# EAGLE design Bomba (EAGLE 6.3)
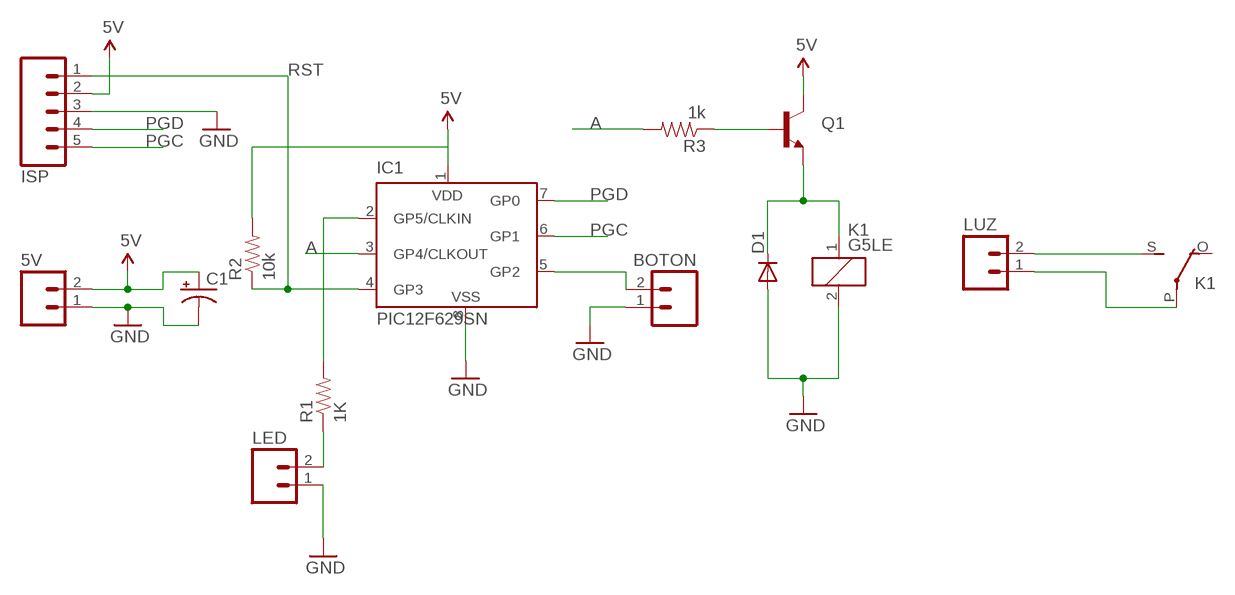
[diagram p0: schematic, sheet 1]

## Parts
5V  M025MM  [SCREWTERMINAL-5MM-2]
BOTON  M025MM  [SCREWTERMINAL-5MM-2]
C1  CAP_POLPTH1  [CPOL-RADIAL-100UF-25V]
D1  DIODE1N4148  [DIODE-1N4148]
IC1  PIC12F629SN  [SO-08]
ISP  M05LOCK_LONGPADS  [1X05_LOCK_LONGPADS]
K1  G5LE  [G5LE]
LED  M02LOCK_LONGPADS  [1X02_LOCK_LONGPADS]
LUZ  M025MM  [SCREWTERMINAL-5MM-2]
Q1  TRANSISTOR_NPNSOT23  [SOT23]
R1  1K  RESISTOR1206  [1206]
R2  10k  RESISTOR1206  [1206]
R3  1k  RESISTOR1206  [1206]

## Nets
5V: 5V.2 C1.1(+) IC1.1(VDD) ISP.2 Q1.3(C) R2.2
A: IC1.3(GP4/CLKOUT) R3.2
GND: 5V.1 BOTON.1 C1.2(-) D1.A IC1.8(VSS) ISP.3 K1.2 LED.1
N$2: D1.C K1.1 Q1.2(E)
N$3: BOTON.2 IC1.5(GP2)
N$4: Q1.1(B) R3.1
N$6: K1.S(2:S) LUZ.2
N$7: K1.P(2:P) LUZ.1
N$8: IC1.2(GP5/CLKIN) R1.2
N$9: LED.2 R1.1
PGC: IC1.6(GP1) ISP.5
PGD: IC1.7(GP0) ISP.4
RST: IC1.4(GP3) ISP.1 R2.1
Unconnected: K1.O(2:O)

## Library data of the parts
5V BOTON LED LUZ = SparkFun-Connectors:M02: Header 2 Standard 2-pin 0.1" header. Use with straight break away headers (SKU : PRT-00116), right angle break away headers (PRT-00553), swiss pins (PRT-00743), machine pins (PRT-00117), and female headers (PRT-00115). Molex polarized connector foot print use with SKU : PRT-08233 with associated crimp pins and housings.
C1 = SparkFun-Passives:CAP_POL: Capacitor Polarized These are standard SMD and PTH capacitors. Normally 10uF, 47uF, and 100uF in electrolytic and tantalum varieties. Always verify the external diameter of the through hole cap, it varies with capacity, voltage, and manufacturer. The EIA devices should be standard.
D1 = SparkFun-DiscreteSemi:DIODE: Diode These are standard reverse protection diodes and small signal diodes. SMA package can handle up to about 1A. SOD-323 can handle about 200mA. What the SOD-323 package when ordering, there are some mfgs out there that are 5-pin packages.
IC1 = microchip:PIC12F6*: Data Sheet 8-Pin FLASH-Based 8-Bit CMOS Microcontrollers Source: http://www.microchip.com .. 41190c.pdf; MF: MICROCHIP; MPN: PIC12F629-I/SN; OC_FARNELL: 9759000; OC_NEWARK: 61K3433
ISP = SparkFun-Connectors:M05: Header 5 Standard 5-pin 0.1" header. Use with straight break away headers (SKU : PRT-00116), right angle break away headers (PRT-00553), swiss pins (PRT-00743), machine pins (PRT-00117), and female headers (PRT-00115). Molex polarized connector foot print use with SKU : PRT-08230 with associated crimp pins and housings.
K1 = relay:G5LE: RELAY 1 x switch, 10 A/120 V AC, 8 A/30 V DC, Omron; OC_FARNELL: unknown; OC_NEWARK: unknown
Q1 = SparkFun-DiscreteSemi:TRANSISTOR_NPN: Generic NPN BJT. MMBT2222 is the common NPN we use. Double check against datasheet- not all devices are the same!
R1-R3 = SparkFun-Passives:RESISTOR: Resistor Basic schematic elements and footprints for 0603, 1206, and PTH resistors.

## Board
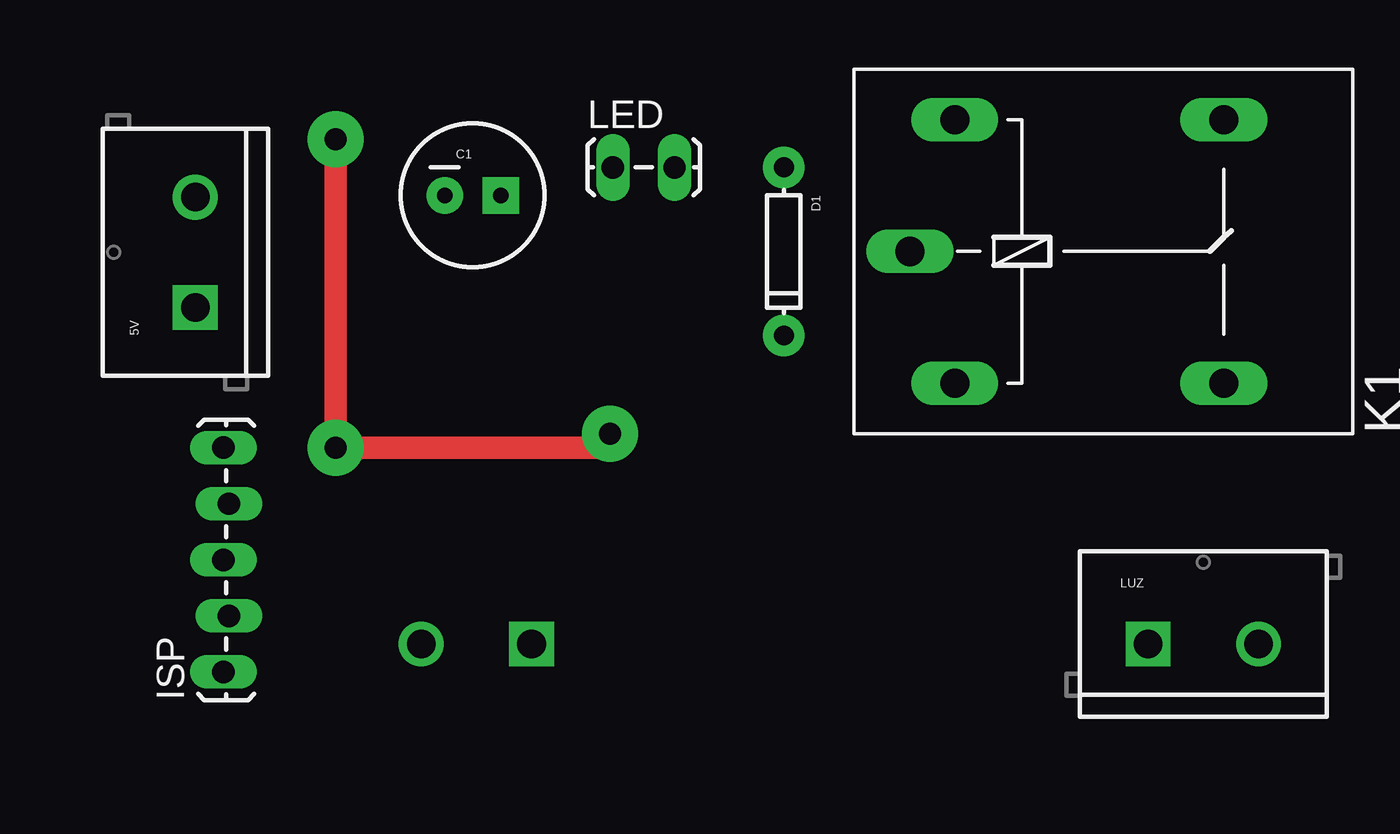
[diagram p1: board, top side]
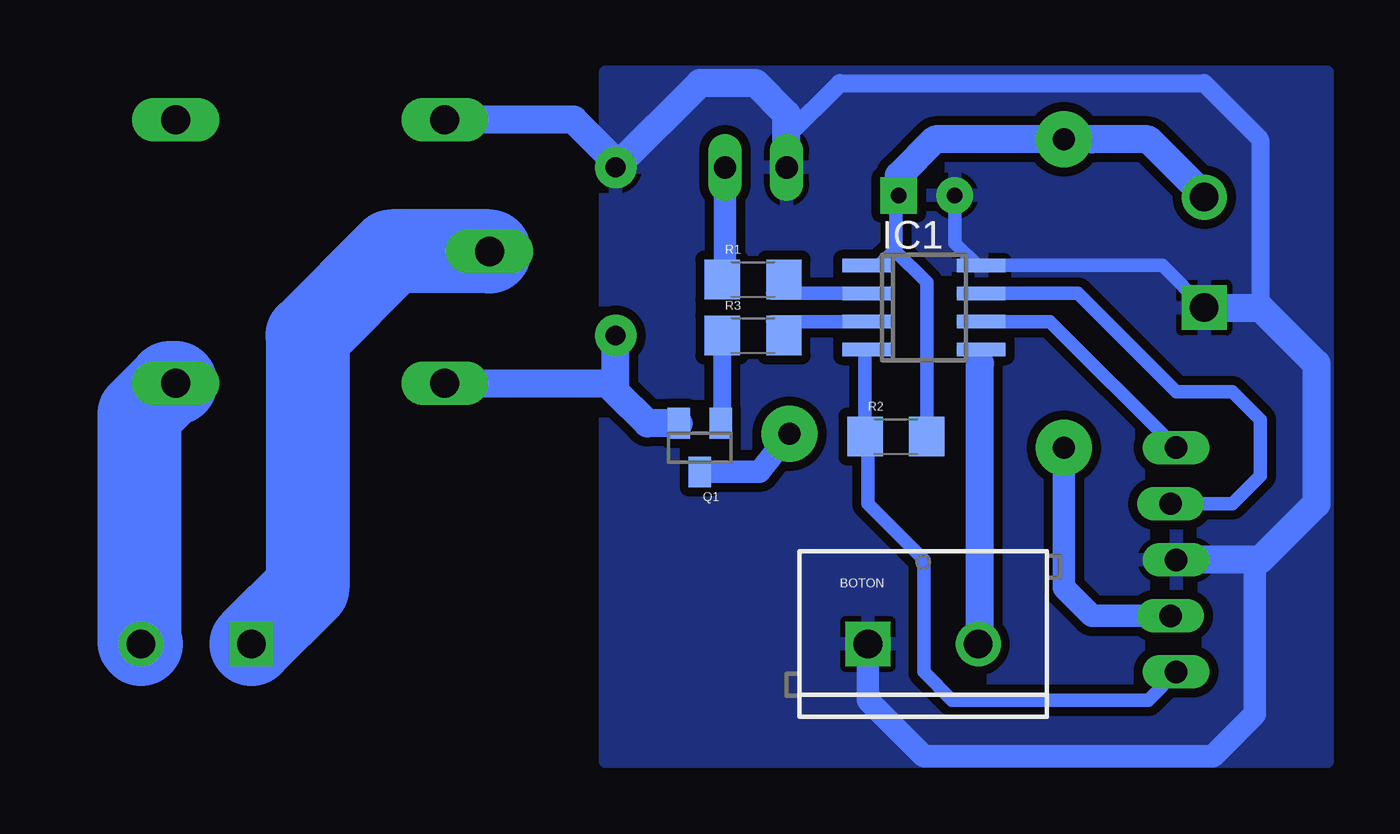
[diagram p2: board, bottom side, seen from below]

No outline drawn. Coordinates in mm, seen from the top.
Copper layers (1*16): Top 0.035mm / dielectric 1.5mm / Bottom 0.035mm
Design rules "default": minimum track width 10mil, minimum drill 24mil, track to track 8mil, track to pad 8mil, pad to pad 8mil, via to via 8mil, smd to smd 8mil, copper to edge 40mil, drill to drill 8mil, minimum pad ring 10mil, minimum via ring 8mil, stop-mask expansion 4mil, vias tented up to drill 0mil, thermal gap 10mil

### Footprints (pad centres in the part's own frame; a part is rotated, then mirrored left to right if it is on the bottom)
SCREWTERMINAL-5MM-2 = drill 1.3 pad 2.032 square: 1 0,0 | drill 1.3 pad 2.032: 2 5,0
CPOL-RADIAL-100UF-25V = drill 0.7 pad 1.651 square: 1 1.27,0 | drill 0.7 pad 1.651: 2 -1.27,0
DIODE-1N4148 = drill 0.9 pad 1.88: A -3.81,0; C 3.81,0
SO-08 = smd 0.6 x 2.2: 1 -1.905,-2.6; 2 -0.635,-2.6; 3 0.635,-2.6; 4 1.905,-2.6; 5 1.905,2.6; 6 0.635,2.6; 7 -0.635,2.6; 8 -1.905,2.6
1X05_LOCK_LONGPADS = drill 1.016 long: 1 0,0; 2 2.54,-0.254; 3 5.08,0; 4 7.62,-0.254; 5 10.16,0
G5LE = drill 1.321 long: 1 -7.493,-5.969; 2 -7.493,5.969; O 4.699,5.969; P -9.525,0; S 4.699,-5.969
1X02_LOCK_LONGPADS = drill 1.016 long: 1 -0.127,0; 2 2.667,0
SOT23 = smd 1 x 1.4: 1 -0.95,-1.1; 2 0.95,-1.1; 3 0,1.1
1206 = smd 1.6 x 1.8: 1 -1.4,0; 2 1.4,0

### Placement (x,y rotation side)
5V  39.37,35.56 90 top
BOTON  54.61,20.32 0 bottom
C1  51.94,40.64 0 top
D1  66.04,38.1 270 top
IC1  52.07,35.56 270 bottom
ISP  40.64,19.05 90 top
K1  81.28,38.1 0 top
LED  58.42,41.91 0 top
LUZ  82.55,20.32 0 top
Q1  62.23,29.21 180 bottom
R1  59.82,36.83 0 bottom
R2  53.34,29.72 0 bottom
R3  59.82,34.29 0 bottom

### Tracks (layer width: path | path; a pad name or v marks a point on that pad's centre or on a via)
5V  (via drill 1 pad 2.54)
  Top 1.016: v58.17,29.84 57.53,29.21 v45.72,29.21 v45.72,43.18
  Bottom 0.61: IC1.1 54.1,37.47 53.4,38.16 | 53.4,38.16 53.34,38.23 53.34,40.51 C1.1 | R2.2 51.94,36.7 53.4,38.16
  Bottom 1.016: Q1.3 59.52,28.11 v58.17,29.84 | ISP.2 44.45,21.59 45.72,22.86 v45.72,29.21
  Bottom 1.27: 5V.2 39.37,40.64 41.91,43.18 44.45,43.18 v45.72,43.18 51.56,43.18 53.21,41.53 C1.1
A
  Bottom 0.61: IC1.3 58.42,34.92 | 58.42,34.92 58.93,34.92 | R3.2 58.42,34.92
GND
  Bottom 0.61: C1.2 50.67,38.48 49.66,37.47 IC1.8 41.27,37.47 5V.1
  Bottom 0.813: LED.1 58.29,43.31 55.88,45.72 39.37,45.72 36.83,43.18 36.83,35.56
  Bottom 1.016: BOTON.1 54.61,17.78 52.07,15.24 38.99,15.24 37.08,17.14 37.08,23.88 36.83,24.13
  Bottom 1.27: K1.2 67.94,44.07 66.04,42.16 D1.A 62.23,45.72 59.69,45.72 58.29,44.32 LED.1 | 5V.1 36.83,35.56 34.29,33.02 34.29,26.67 36.83,24.13 ISP.3
  pour Bottom (isolate 0.406): 66.5,46.23 66.5,15 33.78,15 33.78,46.23
N$2
  Bottom 1.27: Q1.2 64.6,30.31 66.04,31.75 | 66.04,31.75 D1.C | K1.1 66.42,32.13 66.04,31.75
N$3
  Bottom 0.61: 49.53,33.02 49.47,33.02 IC1.5
  Bottom 1.27: BOTON.2 49.53,20.32 49.53,33.02
N$4
  Bottom 0.813: R3.1 61.22,30.37 Q1.1
N$6
  Bottom 3.81: K1.S 86.23,32.13 87.63,30.73 87.63,20.4 LUZ.2
N$7
  Bottom 3.81: K1.P 76.2,38.1 80.01,34.29 80.01,22.86 LUZ.1
N$8
  Bottom 0.61: IC1.2 58.42,36.2 | 58.93,36.2 58.42,36.2 | 58.42,36.2 R1.2
N$9
  Bottom 1.016: R1.1 61.09,36.83 LED.2
PGC
  Bottom 0.61: IC1.6 46.35,34.92 ISP.5
PGD
  Bottom 0.61: ISP.4 38.1,26.67 36.83,27.94 36.83,30.48 38.1,31.75 40.64,31.75 45.09,36.2 IC1.7
RST
  Bottom 0.61: ISP.1 41.91,17.78 50.8,17.78 52.07,19.05 52.07,24.13 54.61,26.67 54.61,29.59 R2.1 54.74,33.59 IC1.4